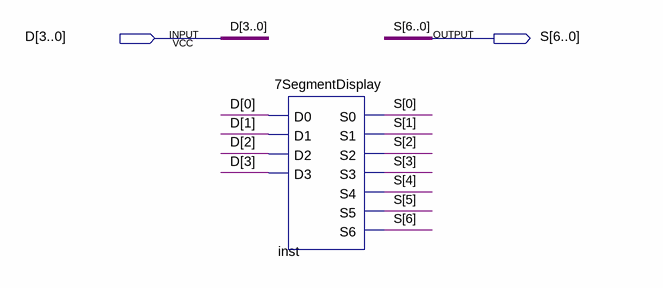
[diagram p0: schematic sheet]
// Quartus schematic BUS_7SegmentsDisplay.bdf as structural Verilog: 1 symbols, 2 pins
module BUS_7SegmentsDisplay (
  input  [3:0] D,
  output [6:0] S
);

  \7SegmentDisplay  inst (
    .D0(D[0]), .D1(D[1]), .D2(D[2]), .D3(D[3]), .S0(S[0]), .S1(S[1]), .S2(S[2]), .S3(S[3]), .S4(S[4]),
    .S5(S[5]), .S6(S[6]));
endmodule
